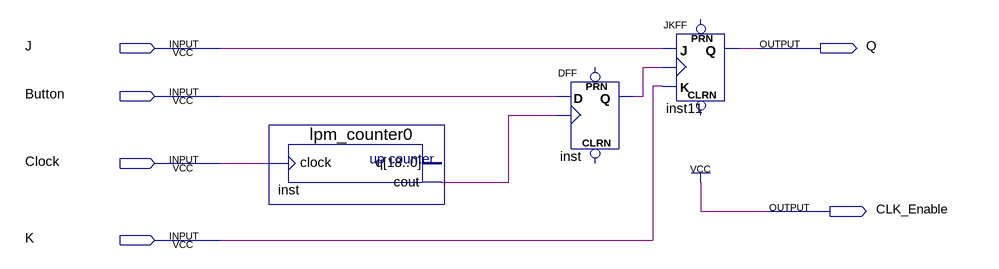
[diagram p0: schematic sheet]
// Quartus schematic lab4_5.bdf as structural Verilog: 3 symbols, 6 pins
module lab4_5 (
  input  J,
  input  Button,
  input  Clock,
  input  K,
  output Q,
  output CLK_Enable
);

  wire inst_cout, inst_q;

  lpm_counter0 inst (.clock(Clock), .cout(inst_cout));  // open: q
  DFF inst_dup2 (.CLK(inst_cout), .D(Button), .Q(inst_q));  // open: CLRN, PRN
  JKFF inst11 (.K(K), .J(J), .CLK(inst_q), .Q(Q));  // open: PRN, CLRN

  assign CLK_Enable = 1'b1;
endmodule
